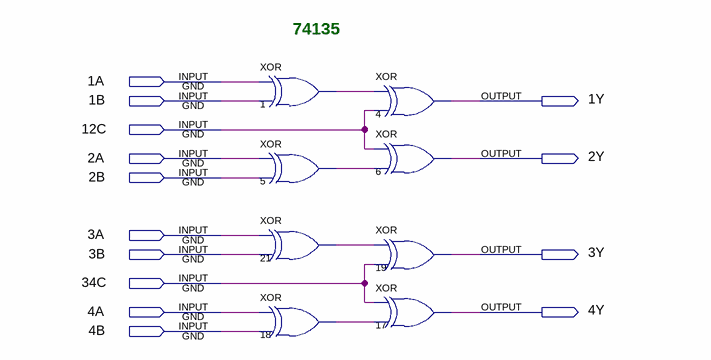
[diagram p0: schematic sheet]
// Quartus schematic 74135.bdf as structural Verilog: 8 symbols, 14 pins
module \74135  (
  input  \1A ,
  input  \1B ,
  input  \12C ,
  input  \2A ,
  input  \2B ,
  input  \3A ,
  input  \3B ,
  input  \34C ,
  input  \4A ,
  input  \4B ,
  output \1Y ,
  output \2Y ,
  output \3Y ,
  output \4Y 
);

  wire n1_out, n5_out, n18_out, n21_out;

  xor u_1 (n1_out, \1A , \1B );
  xor u_5 (n5_out, \2A , \2B );
  xor u_21 (n21_out, \3A , \3B );
  xor u_18 (n18_out, \4A , \4B );
  xor u_4 (\1Y , n1_out, \12C );
  xor u_6 (\2Y , \12C , n5_out);
  xor u_19 (\3Y , n21_out, \34C );
  xor u_17 (\4Y , \34C , n18_out);

  // Notes on the sheet:
  //   74135
endmodule
